# Altium schematic sheet GR_Action.SchDoc
size A4
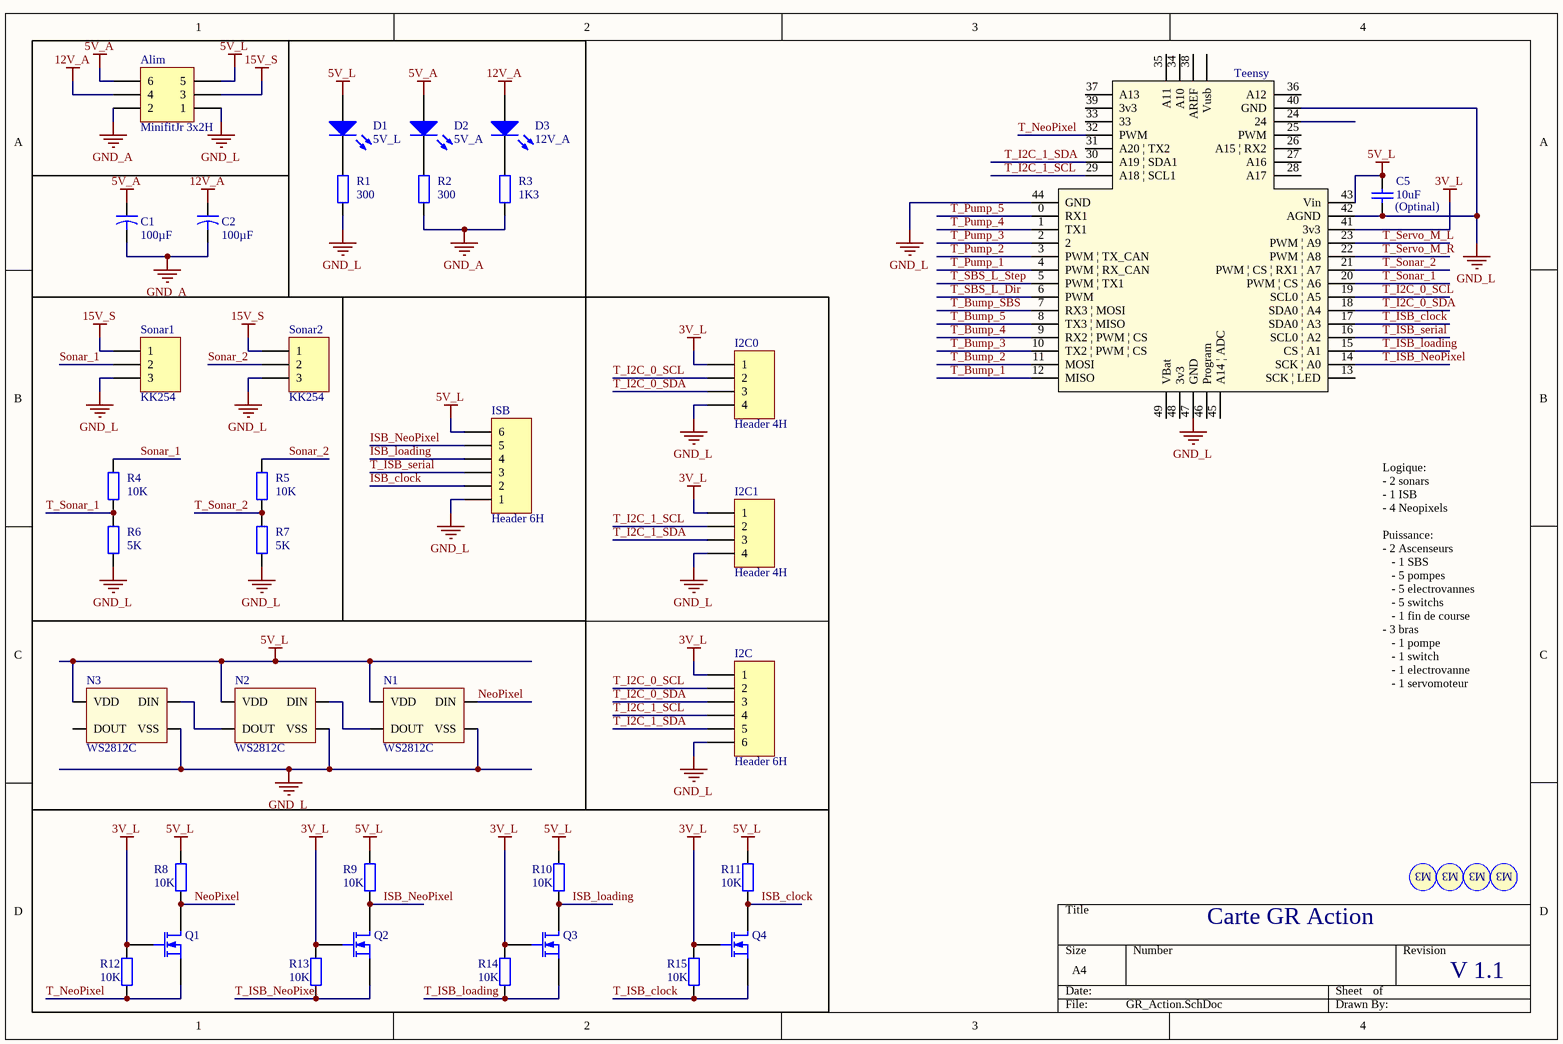
[diagram p0: GR_Action.SchDoc]

## Parts
Alim  MinifitJr 3x2H  [MOLEX_MINIFITJR_3X2]
C1  value 100µF  [Condensateur]  (hidden comment: Cap2)
C2  value 100µF  [Condensateur]  (hidden comment: Cap2)
C5  (Optinal)  value 10uF  [Capacitor 1206]
D1  5V_L  [KP-3216SEC]
D2  5V_A  [KP-3216SEC]
D3  12V_A  [KP-3216SEC]
I2C  Header 6H  [S6B-XH-A]
I2C0  Header 4H  [S4B-XH-A]
I2C1  Header 4H  [S4B-XH-A]
ISB  Header 6H  [S6B-XH-A]
N1  WS2812C  [WS2812C]
N2  WS2812C  [WS2812C]
N3  WS2812C  [WS2812C]
Q1  MOSFET-N  [SOT23_M]  (value not drawn)
Q2  MOSFET-N  [SOT23_M]  (value not drawn)
Q3  MOSFET-N  [SOT23_M]  (value not drawn)
Q4  MOSFET-N  [SOT23_M]  (value not drawn)
R1  value 300  [Resistor 1206]  (hidden comment: Res2)
R2  value 300  [Resistor 1206]  (hidden comment: Res2)
R3  value 1K3  [Resistor 1206]  (hidden comment: Res2)
R4  value 10K  [Resistor 1206]  (hidden comment: Res2)
R5  value 10K  [Resistor 1206]  (hidden comment: Res2)
R6  value 5K  [Resistor 1206]  (hidden comment: Res2)
R7  value 5K  [Resistor 1206]  (hidden comment: Res2)
R8  value 10K  [Resistor 1206]  (hidden comment: Res2)
R9  value 10K  [Resistor 1206]  (hidden comment: Res2)
R10  value 10K  [Resistor 1206]  (hidden comment: Res2)
R11  value 10K  [Resistor 1206]  (hidden comment: Res2)
R12  value 10K  [Resistor 1206]  (hidden comment: Res2)
R13  value 10K  [Resistor 1206]  (hidden comment: Res2)
R14  value 10K  [Resistor 1206]  (hidden comment: Res2)
R15  value 10K  [Resistor 1206]  (hidden comment: Res2)
S1  Screw M3  [Screw M3]  (value not drawn)
S2  Screw M3  [Screw M3]  (value not drawn)
S3  Screw M3  [Screw M3]  (value not drawn)
S4  Screw M3  [Screw M3]  (value not drawn)
Sonar1  KK254  [MOLEX KK254 3X1H M]
Sonar2  KK254  [MOLEX KK254 3X1H M]
Teensy  Teensy 3.2  [teensy]  (value not drawn)

## Nets
3V_L: I2C.1 I2C0.1 I2C1.1 Q1.2(G) Q2.2(G) Q3.2(G) Q4.2(G) R12.2 R13.2 R14.2 R15.2 Teensy.41(3v3)
5V_A: Alim.6 C1.1 D2.1(A)
5V_L: Alim.5 C5.2 D1.1(A) ISB.6 N1.1(VDD) N2.1(VDD) N3.1(VDD) R8.2 R9.2 R10.2 R11.2 Teensy.43(Vin)
12V_A: Alim.4 C2.1 D3.1(A)
15V_S: Alim.3 Sonar1.1 Sonar2.1
GND_A: Alim.2 C1.2 C2.2 R2.2 R3.2
GND_L: Alim.1 C5.1 I2C.6 I2C0.4 I2C1.4 ISB.1 N1.3(VSS) N2.3(VSS) N3.3(VSS) R1.1 R6.2 R7.2 Sonar1.3 Sonar2.3 Teensy.40(GND) Teensy.42(AGND) Teensy.44(GND) Teensy.47(GND)
ISB_clock: ISB.2 Q4.1(D) R11.1
ISB_loading: ISB.4 Q3.1(D) R10.1
ISB_NeoPixel: ISB.5 Q2.1(D) R9.1
NeoPixel: N1.4(DIN) Q1.1(D) R8.1
Sonar_1: R4.1 Sonar1.2
Sonar_2: R5.1 Sonar2.2
T_Bump_1: Teensy.12(MISO)
T_Bump_2: Teensy.11(MOSI)
T_Bump_3: Teensy.10(TX2_|_PWM_|_CS)
T_Bump_4: Teensy.9(RX2_|_PWM_|_CS)
T_Bump_5: Teensy.8(TX3_|_MISO)
T_Bump_SBS: Teensy.7(RX3_|_MOSI)
T_I2C_0_SCL: I2C.2 I2C0.2 Teensy.19(SCL0_|_A5)
T_I2C_0_SDA: I2C.3 I2C0.3 Teensy.18(SDA0_|_A4)
T_I2C_1_SCL: I2C.4 I2C1.2 Teensy.29(A18_|_SCL1)
T_I2C_1_SDA: I2C.5 I2C1.3 Teensy.30(A19_|_SDA1)
T_ISB_clock: Q4.3(S) R15.1 Teensy.17(SDA0_|_A3)
T_ISB_loading: Q3.3(S) R14.1 Teensy.15(CS_|_A1)
T_ISB_NeoPixel: Q2.3(S) R13.1 Teensy.14(SCK_|_A0)
T_ISB_serial: ISB.3 Teensy.16(SCL0_|_A2)
T_NeoPixel: Q1.3(S) R12.1 Teensy.32(PWM)
T_Pump_1: Teensy.4(PWM_|_RX_CAN)
T_Pump_2: Teensy.3(PWM_|_TX_CAN)
T_Pump_3: Teensy.2
T_Pump_4: Teensy.1(TX1)
T_Pump_5: Teensy.0(RX1)
T_SBS_L_Dir: Teensy.6(PWM)
T_SBS_L_Step: Teensy.5(PWM_|_TX1)
T_Servo_M_L: Teensy.23(PWM_|_A9)
T_Servo_M_R: Teensy.22(PWM_|_A8)
T_Sonar_1: R4.2 R6.1 Teensy.20(PWM_|_CS_|_A6)
T_Sonar_2: R5.2 R7.1 Teensy.21(PWM_|_CS_|_RX1_|_A7)
NetD1_2: D1.2(K) R1.2
NetD2_2: D2.2(K) R2.1
NetD3_2: D3.2(K) R3.1
NetN1_2: N1.2(DOUT) N2.4(DIN)
NetN2_2: N2.2(DOUT) N3.4(DIN)

Not connected (* = marked no-connect by the designer): N3 2(DOUT); Teensy 13(SCK_|_LED) 24 25(PWM) 26(A15_|_RX2) 27(A16) 28(A17) 31(A20_|_TX2) 33 34(A10) 35(A11) 36(A12) 37(A13) 38(AREF) 39(3v3) 45(A14_|_ADC) 46(Program) 48(3v3) 49(VBat) 50(Vusb)

## Notes on the sheet
- Logique:
  - 2 sonars
  - 1 ISB
  - 4 Neopixels
  Puissance:
  - 2 Ascenseurs
  - 1 SBS
  - 5 pompes
  - 5 electrovannes
  - 5 switchs
  - 1 fin de course
  - 3 bras
  - 1 pompe
  - 1 switch
  - 1 electrovanne
  - 1 servomoteur
- Carte GR Action
- V 1.1
- (in symbol Screw M3) M3

## Library data of the parts
Alim = Header 3X2H: Header, 3-Pin, Dual row, Right Angle; LatestRevisionDate: 17-Jul-2002; LatestRevisionNote: Re-released for DXP Platform.; Publisher: Altium Limited
C1 C2 = Cap2: Capacitor; Published: 23-Sep-2002; PackageReference: CAPR5-4X5; Publisher: Altium Limited; PackageDescription: Capacitor; 2 Leads
C5 = Cap: Capacitor; Published: 8-Jun-2000; LatestRevisionDate: 17-Jul-2002; LatestRevisionNote: Re-released for DXP Platform.; PackageReference: RAD-0.3; Publisher: Altium Limited; PackageDescription: Radial Cap, Thru-Hole; 2 Leads; 0.3 in Pin Spacing
D1-D3 = LED2: Typical RED, GREEN, YELLOW, AMBER GaAs LED; Published: 8-Jun-2000; LatestRevisionDate: 17-Jul-2002; LatestRevisionNote: Re-released for DXP Platform.; PackageVersion: Feb-2002; PackageReference: 3.2X1.6X1.1; Publisher: Altium Limited; PackageDescription: SM LED; 2 Flat Leads
I2C ISB = Header 6H: Header, 6-Pin, Right Angle; LatestRevisionDate: 17-Jul-2002; LatestRevisionNote: Re-released for DXP Platform.; Publisher: Altium Limited
I2C0 I2C1 = Header 4H: Header, 4-Pin, Right Angle; LatestRevisionDate: 17-Jul-2002; LatestRevisionNote: Re-released for DXP Platform.; Publisher: Altium Limited
N1-N3 = WS2812C: Intelligent control LED
Q1-Q4 = MOSFET-N: N-Channel MOSFET; pin to pad: 2>3 3>2; Published: 8-Jun-2000; LatestRevisionDate: 17-Jul-2002; LatestRevisionNote: Re-released for DXP Platform.; PackageVersion: 1995/1996; PackageReference: E3; Publisher: Altium Limited; PackageDescription: TO, Flat Index; 3 In-Line, Axial Leads; Body Dia. 4.6mm; Lead Dia. 0.5 mm (max)
R1-R15 = Res2: Resistor; Published: 8-Jun-2000; LatestRevisionDate: 17-Jul-2002; LatestRevisionNote: Re-released for DXP Platform.; PackageReference: AXIAL-0.4; Publisher: Altium Limited; PackageDescription: Axial Device, Thru-Hole; 2 Leads; 0.4 in Pin Spacing
Sonar1 Sonar2 = Header 3H: Header, 3-Pin, Right Angle; LatestRevisionDate: 17-Jul-2002; LatestRevisionNote: Re-released for DXP Platform.; Publisher: Altium Limited
Teensy = teensy3.2